# EAGLE design Laser-Driver (EAGLE 7.5.0)
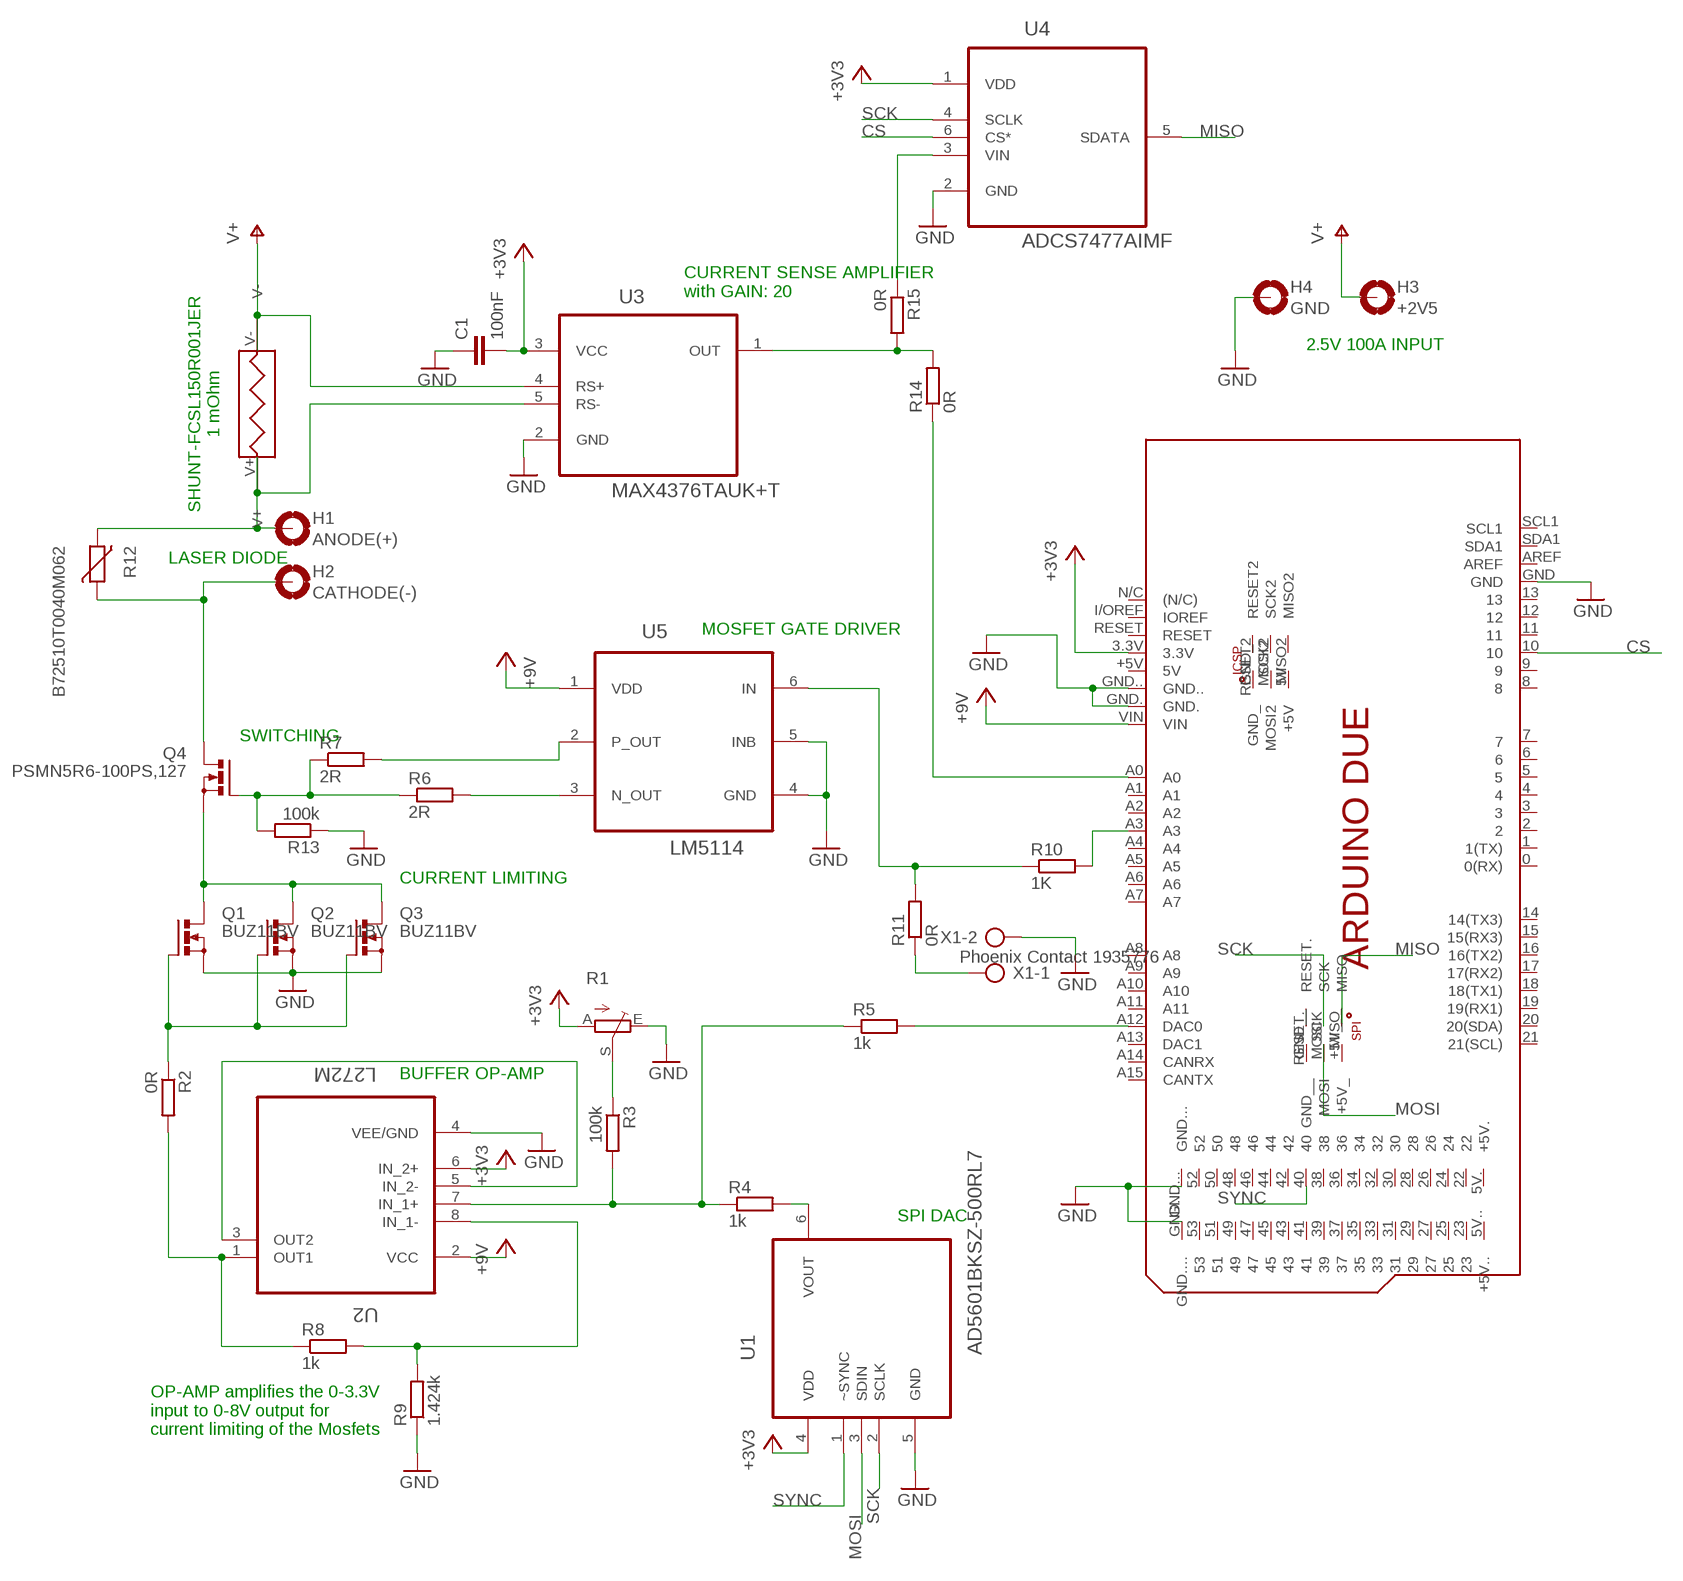
[diagram p0: schematic, sheet 1]

## Parts
C1  100nF  C-EUC0805  [C0805]
H1  ANODE(+)  MOUNT-PAD-ROUND3.2  [3,2-PAD]
H2  CATHODE(-)  MOUNT-PAD-ROUND3.2  [3,2-PAD]
H3  +2V5  MOUNT-PAD-ROUND3.2  [3,2-PAD]
H4  GND  MOUNT-PAD-ROUND3.2  [3,2-PAD]
PCB1  ARDUINO_DUE_SHIELD_SPI  [ARDUINO_DUE_SHIELD_SPI]
Q1  BUZ11BV  [TO220BV]
Q2  BUZ11BV  [TO220BV]
Q3  BUZ11BV  [TO220BV]
Q4  PSMN5R6-100PS,127  BUZ11BV  [TO220BV]
R1  TRIM_EU-B64W  [B64W]
R2  0R  R-EU_R0805  [R0805]
R3  100k  R-EU_R0805  [R0805]
R4  1k  R-EU_R0805  [R0805]
R5  1k  R-EU_R0805  [R0805]
R6  2R  R-EU_R0805  [R0805]
R7  2R  R-EU_R0805  [R0805]
R8  1k  R-EU_R0805  [R0805]
R9  1.424k  R-EU_R0805  [R0805]
R10  1K  R-EU_R0805  [R0805]
R11  0R  R-EU_R0805  [R0805]
R12  B72510T0040M062  VARISTORCN0805  [CT/CN0805]
R13  100k  R-EU_R0805  [R0805]
R14  0R  R-EU_R0805  [R0805]
R15  0R  R-EU_R0805  [R0805]
U1  AD5601BKSZ-500RL7  [SOT65P210X110-6N]
U2  L272M  [DIP254P762X508-8]
U3  MAX4376TAUK+T  MAX4376  [SOT95P280X145-5N]
U4  ADCS7477AIMF  AD7477ARTZ-500RL7  [SOT95P280X145-6N]
U5  LM5114  [SOT95P280X145-6N]
U$1  SHUNT-FCSL150R001-NOKELVIN  [SHUNT-FCSL150R001-NOKELVIN]
X1  Phoenix Contact 1935776  AK500/2  [AK500/2]

## Nets
+2V5: H3.B3,2(MOUNT) U3.4(RS+) U$1.V- ; supply symbol labelled V+
+3V3: C1.2 PCB1.3.3V R1.A U1.4(VDD) U2.6(IN_2+) U3.3(VCC) U4.1(VDD)
+9V: PCB1.VIN U2.2(VCC) U5.1(VDD)
CS: PCB1.10 U4.6(CS*)
GND: C1.1 H4.B3,2(MOUNT) PCB1.GND PCB1.GND. PCB1.GND.. PCB1.GND... PCB1.GND.... Q1.S Q2.S Q3.S R1.E R9.1 R13.1 U1.5(GND) U2.4(VEE/GND) U3.2(GND) U4.2(GND) U5.4(GND) U5.5(INB) X1.2
MISO: PCB1.MISO U4.5(SDATA)
MOSI: PCB1.MOSI U1.3(SDIN)
N$1: R7.2 U5.2(P_OUT)
N$2: H1.B3,2(MOUNT) R12.2 U3.5(RS-) U$1.V+
N$3: Q1.D Q2.D Q3.D Q4.S
N$4: R6.2 U5.3(N_OUT)
N$5: R2.2 R8.1 U2.1(OUT1)
N$6: Q1.G Q2.G Q3.G R2.1
N$7: U2.3(OUT2) U2.5(IN_2-)
N$8: R3.2 R4.1 R5.1 U2.7(IN_1+)
N$9: R1.S R3.1
N$10: R4.2 U1.6(VOUT)
N$11: PCB1.A12(DAC0) R5.2
N$12: PCB1.A0 R14.1
N$13: R8.2 R9.2 U2.8(IN_1-)
N$14: R10.1 R11.2 U5.6(IN)
N$15: PCB1.A3 R10.2
N$16: R11.1 X1.1
N$17: Q4.G R6.1 R7.1 R13.2
N$18: R14.2 R15.2 U3.1(OUT)
N$20: H2.B3,2(MOUNT) Q4.D R12.1
N$24: R15.1 U4.3(VIN)
SCK: PCB1.SCK U1.2(SCLK) U4.4(SCLK)
SYNC: PCB1.40 U1.1(~SYNC)
Unconnected: PCB1.0(0(RX)) PCB1.1(1(TX)) PCB1.2 PCB1.3 PCB1.4 PCB1.5 PCB1.5V(+5V) PCB1.5V.(+5V.) PCB1.5V..(+5V..) PCB1.6 PCB1.7 PCB1.8 PCB1.9 PCB1.11 PCB1.12 PCB1.13 PCB1.14(14(TX3)) PCB1.15(15(RX3)) PCB1.16(16(TX2)) PCB1.17(17(RX2)) PCB1.18(18(TX1)) PCB1.19(19(RX1)) PCB1.20(20(SDA)) PCB1.21(21(SCL)) PCB1.22 PCB1.23 PCB1.24 PCB1.25 PCB1.26 PCB1.27 PCB1.28 PCB1.29 PCB1.30 PCB1.31 PCB1.32 PCB1.33 PCB1.34 PCB1.35 PCB1.36 PCB1.37 PCB1.38 PCB1.39 PCB1.41 PCB1.42 PCB1.43 PCB1.44 PCB1.45 PCB1.46 PCB1.47 PCB1.48 PCB1.49 PCB1.50 PCB1.51 PCB1.52 PCB1.53 PCB1.+5V(5V) PCB1.+5V_ PCB1.A1 PCB1.A2 PCB1.A4 PCB1.A5 PCB1.A6 PCB1.A7 PCB1.A8 PCB1.A9 PCB1.A10 PCB1.A11 PCB1.A13(DAC1) PCB1.A14(CANRX) PCB1.A15(CANTX) PCB1.AREF PCB1.GND_ PCB1.GND__ PCB1.I/OREF(IOREF) PCB1.MISO2 PCB1.MOSI2 PCB1.N/C((N/C)) PCB1.RESET PCB1.RESET2 PCB1.RESET. PCB1.SCK2 PCB1.SCL1 PCB1.SDA1

## Notes on the sheet
- CURRENT SENSE AMPLIFIER
  with GAIN: 20
- 2.5V 100A INPUT
- SHUNT-FCSL150R001JER
  1 mOhm
- LASER DIODE
- MOSFET GATE DRIVER
- SWITCHING
- CURRENT LIMITING
- BUFFER OP-AMP
- SPI DAC
- OP-AMP amplifies the 0-3.3V 
  input to 0-8V output for 
  current limiting of the Mosfets

## Library data of the parts
C1 = rcl:C-EU: CAPACITOR, European symbol
H1-H4 = holes:MOUNT-PAD-ROUND: MOUNTING PAD, round
PCB1 = E14_Arduino_revC:ARDUINO_DUE_SHIELD_SPI: Device for representing an Arduino Due board with a footprint in an EAGLE design. Created by Dave Young for Element14. More EAGLE documentation at: http://www.element14.com/community/community/knode/cadsoft_eagle
Q1-Q4 = transistor-power:BUZ11: N-CHANNEL MOS FET
R1 = pot:TRIM_EU-: POTENTIOMETER
R2-R11 R13-R15 = rcl:R-EU_: RESISTOR, European symbol
R12 = varistor:VARISTOR: VARISTOR
U1 = Analog Devices_By_element14_Batch_1:AD5601BKSZ-500RL7: DAC; MPN: AD5601BKSZ-500RL7; OC_FARNELL: 1117913; OC_NEWARK: 19M0820; PACKAGE: SC-70-6; SUPPLIER: Analog Devices
U2 = Fairchild_By_element14_Batch_1:L272M: Dual Power Operational Amplifier; MPN: L272M; OC_FARNELL: 1094205; OC_NEWARK: 58K1804; PACKAGE: PDIP; SUPPLIER: FAIRCHILD SEMICONDUCTOR
U3 = Maxim_By_element14_Batch_1:MAX4376: Current-Sense Amplifier with Voltage Output; MPN: MAX4372TEUK+T; OC_FARNELL: -; OC_NEWARK: 67K5237; PACKAGE: SOT-23-5; SUPPLIER: Maxim
U4 = ADI-Phase-2:AD7477ARTZ-500RL7: A/D Converters; MPN: AD7477ARTZ-500RL7; OC_FARNELL: unknown; OC_NEWARK: 59K4911; PACKAGE: SOT-23-6; SUPPLIER: Analog Devices
U5 = Texas Instruments_By_element14_Batch_1:LM5114: IC MOSFET GATE DVR 7.6A SOT23-6; MPN: LM5114BMF/NOPB; OC_DIGIKEY: LM5114BMF/NOPBCT-ND; PACKAGE: SOT-23-6; SUPPLIER: TEXAS INSTRUMENTS
U$1 = shunts:SHUNT-FCSL150R001-NOKELVIN
X1 = con-ptr500:AK500/2: CONNECTOR; OC_FARNELL: unknown; OC_NEWARK: unknown

## Board
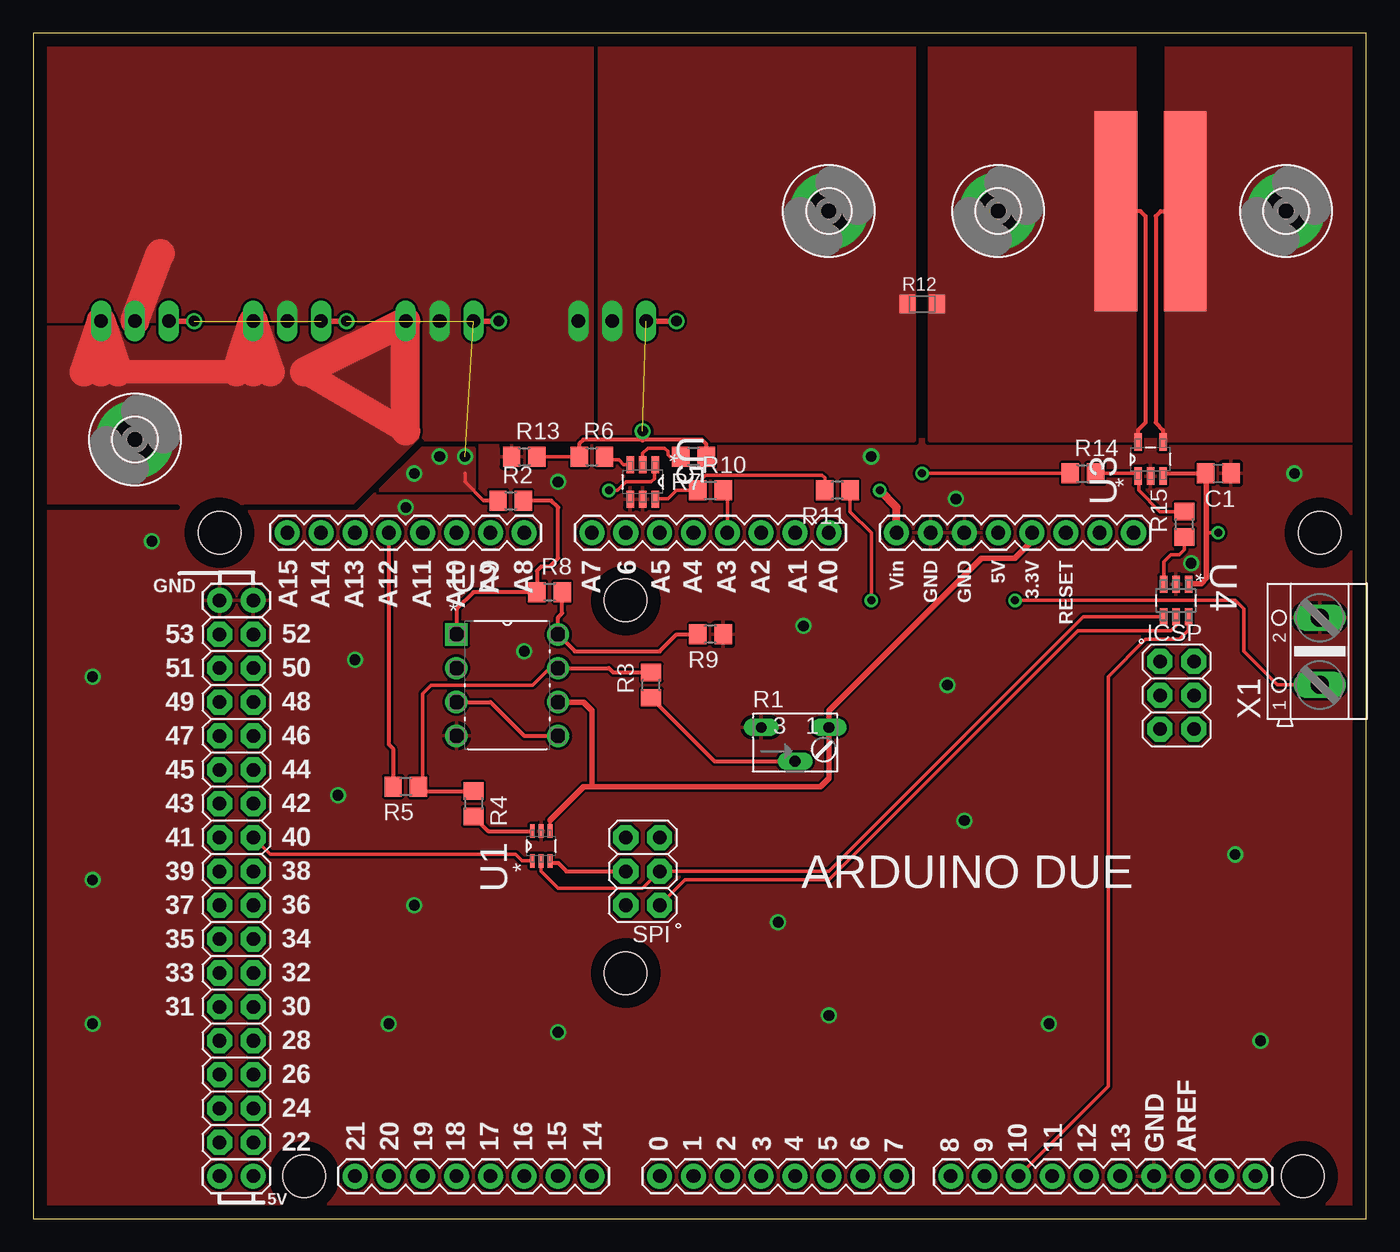
[diagram p1: board, top side]
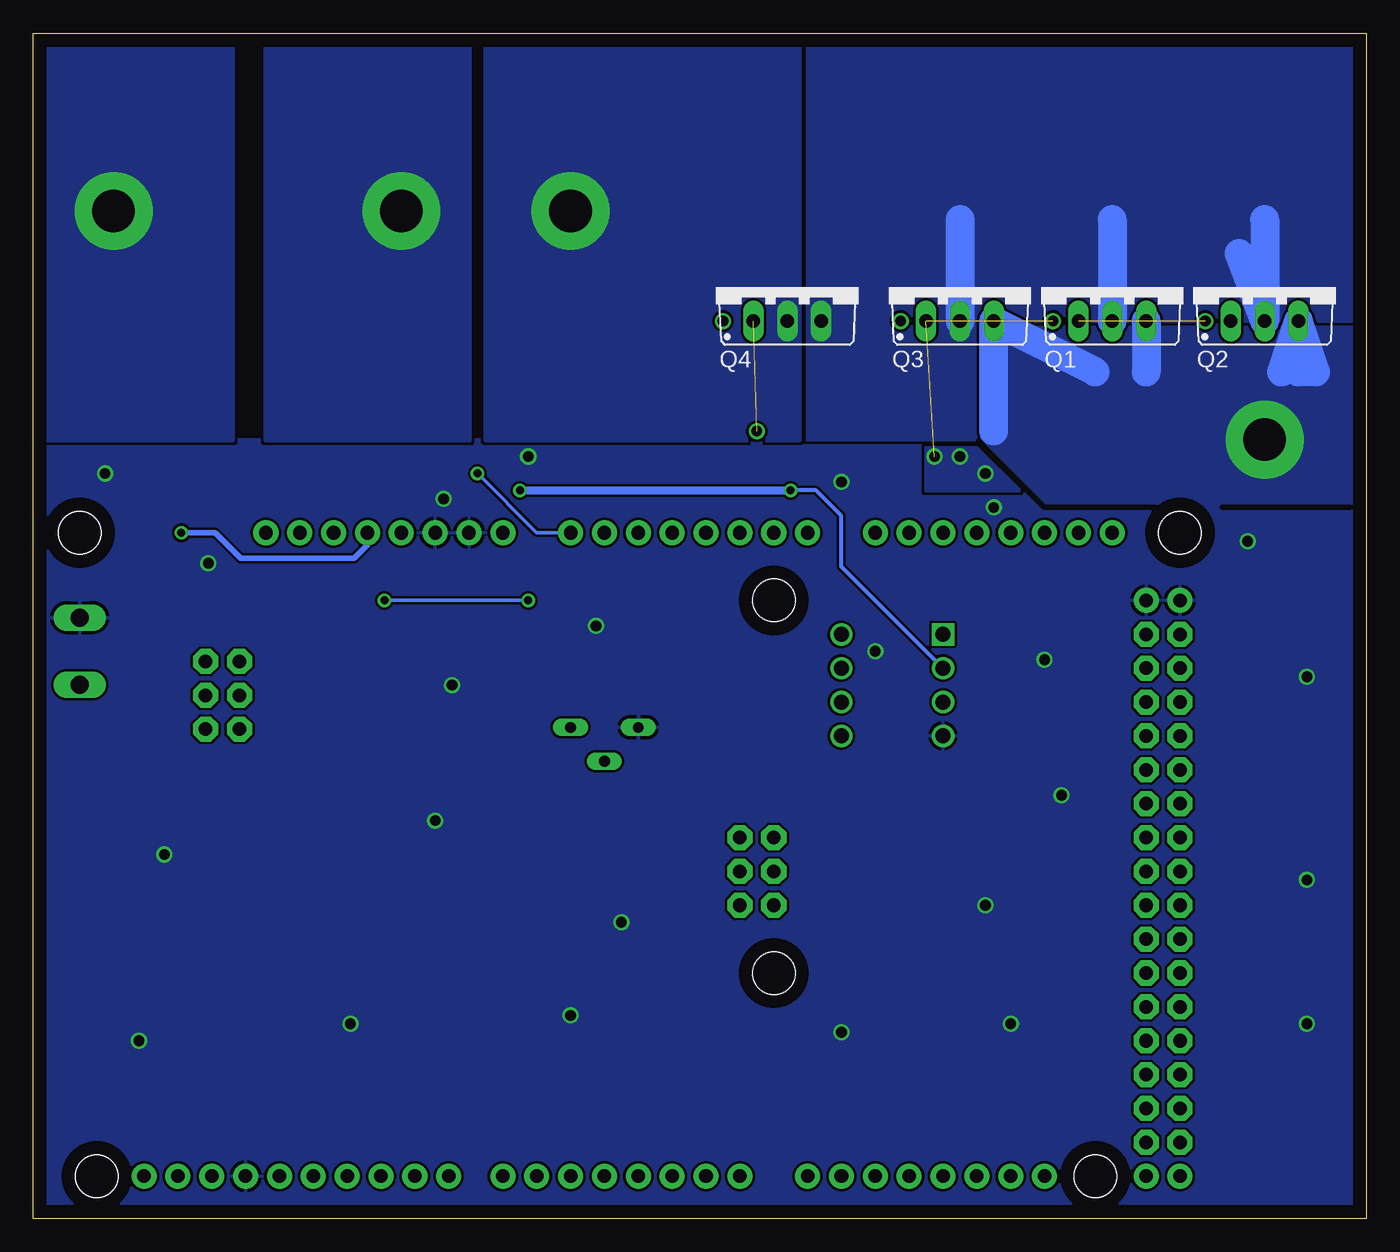
[diagram p2: board, bottom side, seen from below]

Size 100 x 88.89 mm. Coordinates in mm from the lower left corner, seen from the top.
Outline: 0,0 100,0 100,88.89 0,88.89 0,0
Copper layers (1*16): Top 0.035mm / dielectric 1.5mm / Bottom 0.035mm
Design rules "default *": minimum track width 0.192mm, minimum drill 0.25mm, track to track 0.192mm, track to pad 0.192mm, pad to pad 0.192mm, via to via 0.192mm, smd to smd 0.192mm, copper to edge 40mil, drill to drill 8mil, minimum pad ring 10mil, minimum via ring 8mil, stop-mask expansion 4mil, vias tented up to drill 0mil, thermal gap 10mil
tRestrict: 3 lines
bRestrict: 3 lines

### Footprints (pad centres in the part's own frame; a part is rotated, then mirrored left to right if it is on the bottom)
C0805 = smd 1.3 x 1.5: 1 -0.95,0; 2 0.95,0
3,2-PAD = drill 3.2 pad 5.842: B3,2 0,0
ARDUINO_DUE_SHIELD_SPI = drill 1.016 pad 1.88: 0 63.5,50.8; 1 60.96,50.8; 2 58.42,50.8; 3 55.88,50.8; 3.3V 35.56,2.54; 4 53.34,50.8; 5 50.8,50.8; 5V 38.1,2.54; 5V. 93.98,50.8; 5V.. 96.52,50.8; 6 48.26,50.8; 7 45.72,50.8; 8 41.656,50.8; 9 39.116,50.8; 10 36.576,50.8; 11 34.036,50.8; 12 31.496,50.8; 13 28.956,50.8; 14 68.58,50.8; 15 71.12,50.8; 16 73.66,50.8; 17 76.2,50.8; 18 78.74,50.8; 19 81.28,50.8; 20 83.82,50.8; 21 86.36,50.8; A0 50.8,2.54; A1 53.34,2.54; A2 55.88,2.54; A3 58.42,2.54; A4 60.96,2.54; A5 63.5,2.54; A6 66.04,2.54; A7 68.58,2.54; A8 73.66,2.54; A9 76.2,2.54; A10 78.74,2.54; A11 81.28,2.54; A12 83.82,2.54; A13 86.36,2.54; A14 88.9,2.54; A15 91.44,2.54; AREF 23.876,50.8; GND 26.416,50.8; GND. 43.18,2.54; GND.. 40.64,2.54; GND... 93.98,7.62; GND.... 96.52,7.62; I/OREF 30.48,2.54; N/C 27.94,2.54; RESET 33.02,2.54; SCL1 18.796,50.8; SDA1 21.336,50.8; VIN 45.72,2.54 | drill 1.016 pad 1.88 octagon: 22 93.98,48.26; 23 96.52,48.26; 24 93.98,45.72; 25 96.52,45.72; 26 93.98,43.18; 27 96.52,43.18; 28 93.98,40.64; 29 96.52,40.64; 30 93.98,38.1; 31 96.52,38.1; 32 93.98,35.56; 33 96.52,35.56; 34 93.98,33.02; 35 96.52,33.02; 36 93.98,30.48; 37 96.52,30.48; 38 93.98,27.94; 39 96.52,27.94; 40 93.98,25.4; 41 96.52,25.4; 42 93.98,22.86; 43 96.52,22.86; 44 93.98,20.32; 45 96.52,20.32; 46 93.98,17.78; 47 96.52,17.78; 48 93.98,15.24; 49 96.52,15.24; 50 93.98,12.7; 51 96.52,12.7; 52 93.98,10.16; 53 96.52,10.16; +5V 25.959,17.272; +5V_ 66.04,30.48; GND_ 25.959,12.192; GND__ 66.04,25.4; MISO 63.5,30.48; MISO2 23.419,17.272; MOSI 66.04,27.94; MOSI2 25.959,14.732; RESET2 23.419,12.192; RESET. 63.5,25.4; SCK 63.5,27.94; SCK2 23.419,14.732 | hole 3.2: 15.24,50.8; 13.97,2.54; 66.04,35.56; 66.04,7.62; 90.17,50.8; 96.52,2.54
TO220BV = drill 1.016 long: D 0,-2.54; G -2.54,-2.54; S 2.54,-2.54
B64W = drill 0.813 long: A 2.54,0; E -2.54,0; S 0,-2.54
R0805 = smd 1.3 x 1.5: 1 -0.95,0; 2 0.95,0
CT/CN0805 = smd 1.2 x 1.4: 1 -1.1,0; 2 1.1,0
SOT65P210X110-6N = smd 1.016 x 0.356: 1 -1.118,0.66; 2 -1.118,0; 3 -1.118,-0.66; 4 1.118,-0.66; 5 1.118,0; 6 1.118,0.66
DIP254P762X508-8 = drill 1.118 square: 1 -7.62,7.62 | drill 1.118: 2 -7.62,5.08; 3 -7.62,2.54; 4 -7.62,0; 5 0,0; 6 0,2.54; 7 0,5.08; 8 0,7.62
SOT95P280X145-5N = smd 1.321 x 0.559: 1 -1.27,0.94; 2 -1.27,0; 3 -1.27,-0.94; 4 1.27,-0.94; 5 1.27,0.94
SOT95P280X145-6N = smd 1.27 x 0.559: 1 -1.219,0.94; 2 -1.219,0; 3 -1.219,-0.94; 4 1.219,-0.94; 5 1.219,0; 6 1.219,0.94
SOT95P280X145-6N' = smd 1.27 x 0.559: 1 -1.295,0.94; 2 -1.295,0; 3 -1.295,-0.94; 4 1.295,-0.94; 5 1.295,0; 6 1.295,0.94
SHUNT-FCSL150R001-NOKELVIN = smd 3.2 x 15: V+ -2.6,0; V- 2.6,0
AK500/2 = drill 1.321 long: 1 -2.515,0; 2 2.515,0

### Placement (x,y rotation side)
C1  88.9,55.88 180 top
H1  72.39,75.56 0 top
H2  59.69,75.56 0 top
H3  93.98,75.56 0 top
H4  7.62,58.42 0 top
PCB1  110.49,53.98 180 top
Q1  19.05,69.85 0 bottom
Q2  7.62,69.85 0 bottom
Q3  30.48,69.85 0 bottom
Q4  43.43,69.85 0 bottom
R1  57.15,36.83 0 top
R2  35.81,53.85 0 top
R3  46.35,40.01 90 top
R4  33.02,31.11 270 top
R5  27.94,32.38 180 top
R6  41.91,57.15 0 top
R7  49.53,57.15 180 top
R8  38.73,46.99 0 top
R9  50.8,43.81 180 top
R10  50.8,54.61 0 top
R11  60.33,54.61 180 top
R12  66.67,68.58 0 top
R13  36.83,57.15 0 top
R14  78.74,55.88 0 top
R15  86.36,52.07 90 top
U1  38.1,27.94 90 top
U2  39.37,36.2 0 top
U3  83.82,56.96 90 top
U4  85.72,46.35 270 top
U5  LM5114  [SOT95P280X145-6N']  45.72,55.24 270 top
U$1  83.82,75.56 0 top
X1  96.52,42.55 90 top

### Tracks (layer width: path | path; a pad name or v marks a point on that pad's centre or on a via)
+2V5
  Top 0.305: U3.4 84.76,59.13 84.2,59.69 84.2,75.18 84.58,75.56 U$1.V-
  pour Top (no thermals): 85.09,89.53 100.33,89.53 100.33,58.42 85.09,58.42
  pour Bottom (no thermals): 85.09,89.53 100.33,89.53 99.69,58.42 85.09,58.42
+3V3  (via drill 0.6)
  Top 0.254: 38.76,29.87 U1.4 | C1.2 88.01,55.82 | U4.1 86.72,47.62 | v88.9,51.44 88.01,51.44
  Top 0.305: U3.3 84.95,55.88 C1.2
  Top 0.406: 41.91,32.38 59.05,32.38 59.69,33.02 R1.A 59.69,38.1 71.12,49.53 73.66,49.53 74.93,50.8 PCB1.3.3V | 41.91,32.38 41.27,32.38 38.76,29.87 | U2.6 41.27,38.73 41.91,38.1 41.91,32.38 | 86.72,47.62 87.63,47.62 88.01,48.01 88.01,51.44 88.01,55.82
  Bottom 0.406: PCB1.3.3V 74.93,50.55 75.95,49.53 84.45,49.53 86.36,51.44 v88.9,51.44
+9V  (via drill 0.6)
  Top 0.254: U5.1 46.61,56.49 46.61,55.5 46.35,55.24 44.45,55.24 43.81,54.61 v43.18,54.61
  Top 0.406: v43.18,54.61 43.2,54.59
  Top 0.61: PCB1.VIN 64.77,53.34 v63.5,54.61
  Bottom 0.305: U2.2 39.37,48.9 39.37,52.7 41.27,54.61 v43.18,54.61
  Bottom 0.61: v63.5,54.61 v43.18,54.61
CS
  Top 0.254: U4.6 86.67,44.12 85.98,43.43 83.44,43.43 80.64,40.64 80.64,9.91 PCB1.10
GND  (via drill 0.8)
  Top 1.778: 6.35,63.5 15.24,63.5 | 16.51,63.5 17.78,63.5 | 20.32,63.5 27.94,59.05
  Top 2.184: Q2.S 5.08,63.5 | 27.94,59.05 Q3.S 20.32,63.5 | 16.51,63.5 Q1.S | 3.81,63.5 Q2.S | Q2.S 6.35,63.5 | 15.24,63.5 Q1.S | Q1.S 17.78,63.5
  Bottom 2.184: Q2.S 5.08,63.5 3.81,63.5 Q2.S | Q1.S 16.51,63.5 | 27.94,59.05 Q3.S 20.32,63.5 | Q2.S 6.35,63.5
  other vias: 27.94,53.34 39.37,55.24 8.89,50.8 4.45,14.61 4.45,40.64 4.45,25.4 26.67,14.61 28.57,23.5 39.37,13.97 55.88,22.23 59.69,15.24 69.85,29.84 76.2,14.61 90.17,27.3 92.08,13.34 68.58,40.01 57.78,44.45 36.83,42.55 24.13,41.91 22.86,31.75 94.61,55.88 69.22,53.98 62.87,57.15 86.87,49.15
  pour Top (rank 2, no thermals): 0,67.31 29.21,67.31 29.21,58.42 24.13,53.34 0,53.34
  pour Bottom (rank 2, no thermals): 0,67.31 29.21,62.23 29.21,58.42 24.13,53.34 0,53.34
  pour Bottom (rank 2, no thermals): 0,67.31 29.21,67.31 29.21,58.42 24.13,53.34 0,53.34
  pour Top (rank 3): 103.5,58.42 102.87,-1.27 -1.27,-1.27 -0.64,58.42
  pour Bottom (rank 3): 103.5,58.42 102.87,-1.27 -1.27,-1.27 -0.64,58.42
MISO
  Top 0.254: PCB1.MISO 48.9,25.4 59.69,25.4 78.36,44.07 85.34,44.07 85.72,44.45 U4.5
MOSI
  Top 0.305: U1.3 38.91,26.67 39.37,26.67 40.01,26.04 PCB1.MOSI
N$1
  Top 0.254: U5.2 45.72,57.4 46.1,57.78 47.37,57.78 47.62,57.53 47.62,57.28 47.75,57.15 R7.2
N$2
  Top 0.305: U3.5 82.88,59.13 83.44,59.69 83.44,75.18 83.06,75.56 U$1.V+
  pour Top (no thermals): 82.55,89.53 67.31,89.53 67.31,58.42 82.55,58.42
  pour Bottom (no thermals): 82.55,89.53 67.31,89.53 67.31,58.42 82.55,58.42
N$3
  Top 2.184: Q2.D 9.53,72.39
  Bottom 2.184: 7.62,74.93 Q2.D 9.53,72.39 | 19.05,74.93 Q1.D | 30.48,74.93 Q3.D
  pour Top (no thermals): 41.91,78.74 41.91,58.42 29.21,58.42 29.21,67.31 0,67.31 0,89.53 41.91,89.53
  pour Bottom (no thermals): 41.91,78.74 41.91,58.42 29.21,58.42 29.21,67.31 0,67.31 0,89.53 41.91,89.53
N$4
  Top 0.254: R6.2 43.11,56.9 43.94,56.9 44.3,56.54 U5.3
N$5
  Top 0.305: U2.1 31.75,45.72 33.02,46.99 R8.1 37.78,48.58 38.1,48.9 38.73,48.9 39.37,49.53 39.37,53.34 38.86,53.85 R2.2
N$6  (via drill 0.8)  (3 unrouted)
  Top 0.254: 33.78,53.85 32.38,55.24 32.38,55.88
  Top 0.305: R2.1 33.78,53.85
  Top 0.406: Q2.G v12.06,67.31 | Q1.G v23.5,67.31 | Q3.G v34.92,67.31
  other vias: 28.57,55.88 32.38,57.15 30.48,57.15
  pour Bottom: 29.21,57.78 33.02,57.78 33.02,54.61 26.04,54.61
  pour Top: 29.21,57.78 33.02,57.78 33.02,54.61 26.04,54.61
N$7
  Top 0.305: U2.3 34.29,38.73 36.83,36.2 U2.5
N$8
  Top 0.254: R5.1 29.21,32.7 29.21,39.37 29.84,40.01 37.47,40.01 38.73,41.27 U2.7
  Top 0.305: R5.1 29.21,32.06 R4.1 33.34,32.38 | U2.7 43.18,41.27 43.5,40.95 R3.2
N$9
  Top 0.305: R3.1 51.12,34.29 R1.S
N$10
  Top 0.305: R4.2 34.13,29.06 U1.6
N$11
  Top 0.305: PCB1.A12 26.67,35.56 26.99,35.24 R5.2
N$12  (via drill 0.6)
  Top 0.254: R14.1 v66.67,55.88
  Bottom 0.254: v66.67,55.88 62.23,51.44 PCB1.A0
N$13
  Top 0.305: R8.2 39.69,45.4 39.37,45.09 U2.8 40.64,42.55 46.99,42.55 48.26,43.81 R9.2
N$14
  Top 0.254: R11.2 59.38,55.56 59.18,55.75 50.42,55.75 50.16,55.5 50.16,54.3 R10.1 48.26,54.61 47.62,53.98 46.69,53.98 U5.6
N$15
  Top 0.254: R10.2 52.07,54.29 PCB1.A3
N$16  (via drill 0.6)
  Top 0.254: X1.1 93.32,40.03 90.81,42.55 90.81,45.72 90.17,46.35 v73.66,46.35 | v62.87,46.35 62.87,51.44 61.27,53.02 R11.1
  Bottom 0.254: v73.66,46.35 v62.87,46.35
N$17  (via drill 0.8)  (1 unrouted)
  Top 0.254: R13.2 R6.1
  Top 0.305: 41.27,57.47 R6.1 40.96,58.1 41.27,58.42 45.72,58.42 50.16,58.42 50.48,58.1 R7.1
  Top 0.406: Q4.G v48.26,67.31 | v45.72,59.05 45.72,58.42
N$18
  Top 0.254: R14.2 82.69,55.88 U3.1 82.93,55.64 82.93,54.61 84.52,53.02 R15.2
N$20
  pour Top (no thermals): 42.55,58.42 42.55,88.9 66.04,88.9 66.04,58.42
  pour Bottom (no thermals): 42.55,58.42 42.55,89.53 66.04,89.53 66.04,58.42
N$24
  Top 0.254: U4.3 84.84,48.26 84.84,49.28 85.34,49.78 85.98,49.78 86.36,50.16 R15.1
SCK
  Top 0.254: U1.2 38.1,26.04 39.37,24.77 45.72,24.77 PCB1.SCK 59.69,26.04 78.79,45.14 U4.4
SYNC
  Top 0.254: PCB1.40 17.78,27.3 36.2,27.3 36.68,26.82 U1.1